# EAGLE board SE-Exp30 (EAGLE 9.6.2), part 1 of 2
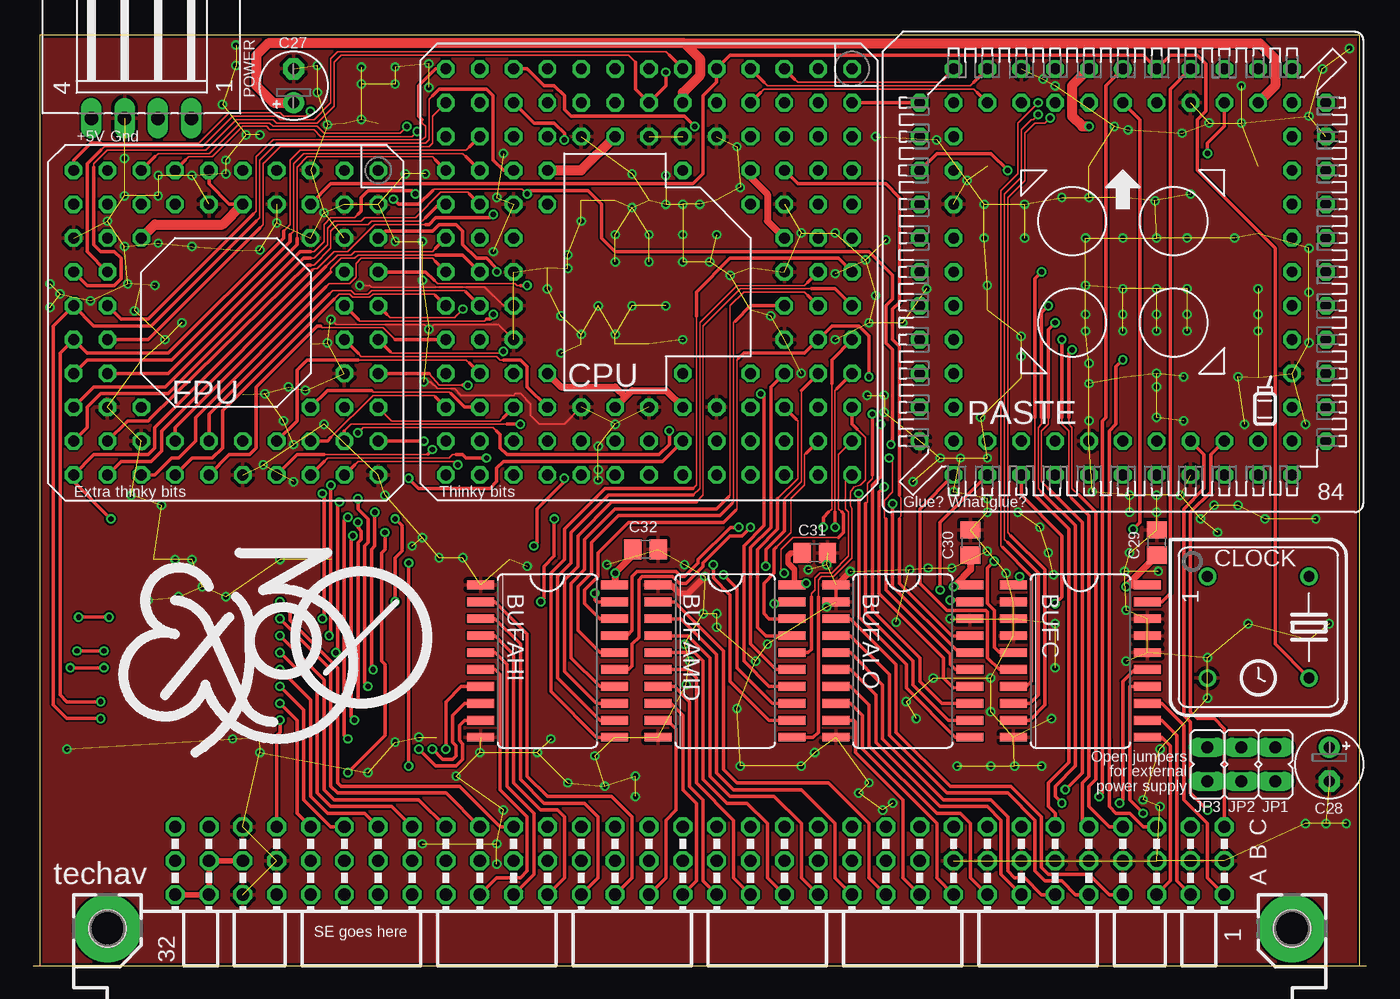
[diagram p1: board, top side]
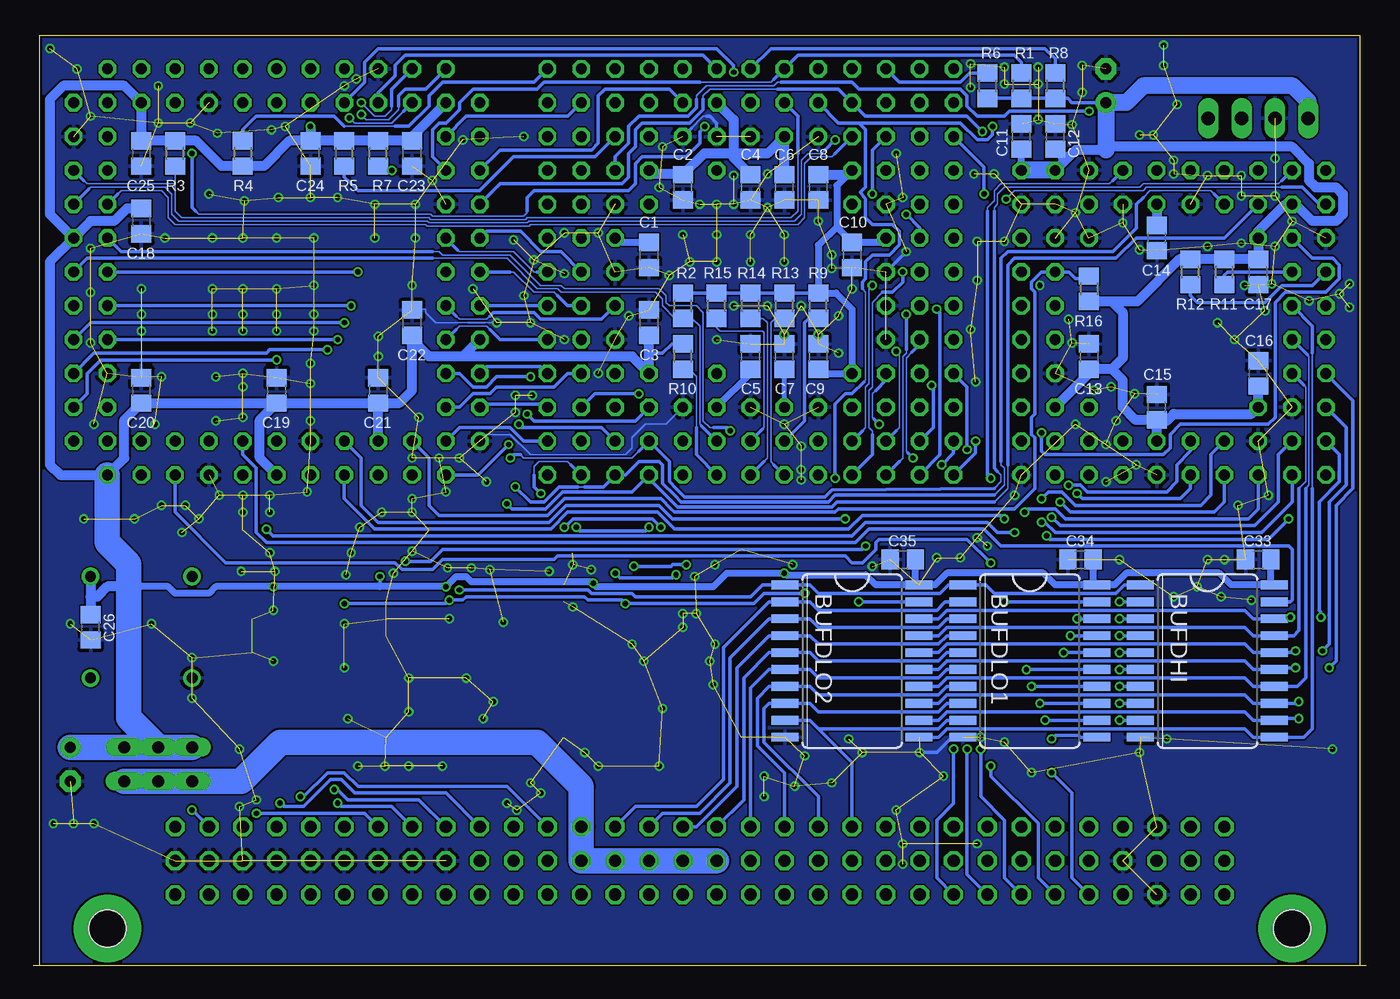
[diagram p2: board, bottom side, seen from below]

Size 99.06 x 69.85 mm. Coordinates in mm from the lower left corner, seen from the top.
Outline: 0,0 99.06,0 99.06,69.85 0,69.85 0,0
Copper layers (1*16): Top 0.035mm / dielectric 1.5mm / Bottom 0.035mm
Design rules "jlcpcb_v1 *": minimum track width 5mil, minimum drill 0.3mm, track to track 5mil, track to pad 5mil, pad to pad 5mil, via to via 5mil, smd to smd 0mil, copper to edge 0.2mm, drill to drill 10mil, minimum pad ring 10mil, minimum via ring 6mil, stop-mask expansion 2mil, vias tented up to drill 25mil, thermal gap 10mil

## Footprints (pad centres in the part's own frame; a part is rotated, then mirrored left to right if it is on the bottom)
74XX-US_SO20W = smd 0.66 x 2.032: 1 -5.715,-5.029; 2 -4.445,-5.029; 3 -3.175,-5.029; 4 -1.905,-5.029; 5 -0.635,-5.029; 6 0.635,-5.029; 7 1.905,-5.029; 8 3.175,-5.029; 9 4.445,-5.029; 10 5.715,-5.029; 11 5.715,5.029; 12 4.445,5.029; 13 3.175,5.029; 14 1.905,5.029; 15 0.635,5.029; 16 -0.635,5.029; 17 -1.905,5.029; 18 -3.175,5.029; 19 -4.445,5.029; 20 -5.715,5.029
RCL_C0805 = smd 1.3 x 1.5: 1 -0.95,0; 2 0.95,0
RCL_E2,5-5 = drill 0.813 pad 1.6: + -1.27,0 | drill 0.813 pad 1.6 octagon: - 1.27,0
CRYSTAL_DIL08S = drill 0.813: 1 -3.81,-3.81; 4 3.81,-3.81; 5 3.81,3.81; 8 -3.81,3.81
MICRO-MC68000_MPGA128 = drill 0.813 octagon: A01 -15.24,15.24; A02 -12.7,15.24; A03 -10.16,15.24; A04 -7.62,15.24; A05 -5.08,15.24; A06 -2.54,15.24; A07 0,15.24; A08 2.54,15.24; A09 5.08,15.24; A10 7.62,15.24; A11 10.16,15.24; A12 12.7,15.24; A13 15.24,15.24; B01 -15.24,12.7; B02 -12.7,12.7; B03 -10.16,12.7; B04 -7.62,12.7; B05 -5.08,12.7; B06 -2.54,12.7; B07 0,12.7; B08 2.54,12.7; B09 5.08,12.7; B10 7.62,12.7; B11 10.16,12.7; B12 12.7,12.7; B13 15.24,12.7; C01 -15.24,10.16; C02 -12.7,10.16; C03 -10.16,10.16; C04 -7.62,10.16; C05 -5.08,10.16; C06 -2.54,10.16; C07 0,10.16; C08 2.54,10.16; C09 5.08,10.16; C10 7.62,10.16; C11 10.16,10.16; C12 12.7,10.16; C13 15.24,10.16; D01 -15.24,7.62; D02 -12.7,7.62; D03 -10.16,7.62; D04 -7.62,7.62; D05 -5.08,7.62; D10 7.62,7.62; D11 10.16,7.62; D12 12.7,7.62; D13 15.24,7.62; E01 -15.24,5.08; E02 -12.7,5.08; E03 -10.16,5.08; E11 10.16,5.08; E12 12.7,5.08; E13 15.24,5.08; F01 -15.24,2.54; F02 -12.7,2.54; F03 -10.16,2.54; F04 -7.62,2.54; F10 7.62,2.54; F11 10.16,2.54; F12 12.7,2.54; F13 15.24,2.54; G01 -15.24,0; G02 -12.7,0; G03 -10.16,0; G11 10.16,0; G12 12.7,0; G13 15.24,0; H01 -15.24,-2.54; H02 -12.7,-2.54; H03 -10.16,-2.54; H11 10.16,-2.54; H12 12.7,-2.54; H13 15.24,-2.54; J01 -15.24,-5.08; J02 -12.7,-5.08; J03 -10.16,-5.08; J11 10.16,-5.08; J12 12.7,-5.08; J13 15.24,-5.08; K01 -15.24,-7.62; K02 -12.7,-7.62; K03 -10.16,-7.62; K04 -7.62,-7.62; K05 -5.08,-7.62; K10 7.62,-7.62; K11 10.16,-7.62; K12 12.7,-7.62; K13 15.24,-7.62; L01 -15.24,-10.16; L02 -12.7,-10.16; L03 -10.16,-10.16; L04 -7.62,-10.16; L05 -5.08,-10.16; L06 -2.54,-10.16; L07 0,-10.16; L08 2.54,-10.16; L09 5.08,-10.16; L10 7.62,-10.16; L11 10.16,-10.16; L12 12.7,-10.16; L13 15.24,-10.16; M01 -15.24,-12.7; M02 -12.7,-12.7; M03 -10.16,-12.7; M04 -7.62,-12.7; M05 -5.08,-12.7; M06 -2.54,-12.7; M07 0,-12.7; M08 2.54,-12.7; M09 5.08,-12.7; M10 7.62,-12.7; M11 10.16,-12.7; M12 12.7,-12.7; M13 15.24,-12.7; N01 -15.24,-15.24; N02 -12.7,-15.24; N03 -10.16,-15.24; N04 -7.62,-15.24; N05 -5.08,-15.24; N06 -2.54,-15.24; N07 0,-15.24; N08 2.54,-15.24; N09 5.08,-15.24; N10 7.62,-15.24; N11 10.16,-15.24; N12 12.7,-15.24; N13 15.24,-15.24
MICRO-MC68000_MPGA68 = drill 0.813 octagon: A01 -11.43,11.43; A02 -8.89,11.43; A03 -6.35,11.43; A04 -3.81,11.43; A05 -1.27,11.43; A06 1.27,11.43; A07 3.81,11.43; A08 6.35,11.43; A09 8.89,11.43; A10 11.43,11.43; B01 -11.43,8.89; B02 -8.89,8.89; B03 -6.35,8.89; B04 -3.81,8.89; B05 -1.27,8.89; B06 1.27,8.89; B07 3.81,8.89; B08 6.35,8.89; B09 8.89,8.89; B10 11.43,8.89; C01 -11.43,6.35; C02 -8.89,6.35; C03 -6.35,6.35; C08 6.35,6.35; C09 8.89,6.35; C10 11.43,6.35; D01 -11.43,3.81; D02 -8.89,3.81; D09 8.89,3.81; D10 11.43,3.81; E01 -11.43,1.27; E02 -8.89,1.27; E09 8.89,1.27; E10 11.43,1.27; F01 -11.43,-1.27; F02 -8.89,-1.27; F09 8.89,-1.27; F10 11.43,-1.27; G01 -11.43,-3.81; G02 -8.89,-3.81; G09 8.89,-3.81; G10 11.43,-3.81; H01 -11.43,-6.35; H02 -8.89,-6.35; H03 -6.35,-6.35; H08 6.35,-6.35; H09 8.89,-6.35; H10 11.43,-6.35; J01 -11.43,-8.89; J02 -8.89,-8.89; J03 -6.35,-8.89; J04 -3.81,-8.89; J05 -1.27,-8.89; J06 1.27,-8.89; J07 3.81,-8.89; J08 6.35,-8.89; J09 8.89,-8.89; J10 11.43,-8.89; K01 -11.43,-11.43; K02 -8.89,-11.43; K03 -6.35,-11.43; K04 -3.81,-11.43; K05 -1.27,-11.43; K06 1.27,-11.43; K07 3.81,-11.43; K08 6.35,-11.43; K09 8.89,-11.43; K10 11.43,-11.43
JUMPER_JP1 = drill 0.914 long: 1 0,-1.27; 2 0,1.27
SE-EXP30_S84 = drill 0.813: 1 0,15.24 | drill 0.813 octagon: 2 0,12.7; 3 -2.54,15.24; 4 -2.54,12.7; 5 -5.08,15.24; 6 -5.08,12.7; 7 -7.62,15.24; 8 -7.62,12.7; 9 -10.16,15.24; 10 -10.16,12.7; 11 -12.7,15.24; 12 -15.24,12.7; 13 -12.7,12.7; 14 -15.24,10.16; 15 -12.7,10.16; 16 -15.24,7.62; 17 -12.7,7.62; 18 -15.24,5.08; 19 -12.7,5.08; 20 -15.24,2.54; 21 -12.7,2.54; 22 -15.24,0; 23 -12.7,0; 24 -15.24,-2.54; 25 -12.7,-2.54; 26 -15.24,-5.08; 27 -12.7,-5.08; 28 -15.24,-7.62; 29 -12.7,-7.62; 30 -15.24,-10.16; 31 -12.7,-10.16; 32 -15.24,-12.7; 33 -12.7,-15.24; 34 -12.7,-12.7; 35 -10.16,-15.24; 36 -10.16,-12.7; 37 -7.62,-15.24; 38 -7.62,-12.7; 39 -5.08,-15.24; 40 -5.08,-12.7; 41 -2.54,-15.24; 42 -2.54,-12.7; 43 0,-15.24; 44 0,-12.7; 45 2.54,-15.24; 46 2.54,-12.7; 47 5.08,-15.24; 48 5.08,-12.7; 49 7.62,-15.24; 50 7.62,-12.7; 51 10.16,-15.24; 52 10.16,-12.7; 53 12.7,-15.24; 54 15.24,-12.7; 55 12.7,-12.7; 56 15.24,-10.16; 57 12.7,-10.16; 58 15.24,-7.62; 59 12.7,-7.62; 60 15.24,-5.08; 61 12.7,-5.08; 62 15.24,-2.54; 63 12.7,-2.54; 64 15.24,0; 65 12.7,0; 66 15.24,2.54; 67 12.7,2.54; 68 15.24,5.08; 69 12.7,5.08; 70 15.24,7.62; 71 12.7,7.62; 72 15.24,10.16; 73 12.7,10.16; 74 15.24,12.7; 75 12.7,15.24; 76 12.7,12.7; 77 10.16,15.24; 78 10.16,12.7; 79 7.62,15.24; 80 7.62,12.7; 81 5.08,15.24; 82 5.08,12.7; 83 2.54,15.24; 84 2.54,12.7
CON-AMP-MT_L04P = drill 1.016 long: 1 3.75,-6.25; 2 1.25,-6.25; 3 -1.25,-6.25; 4 -3.75,-6.25
RCL_R0805 = smd 1.3 x 1.5: 1 -0.95,0; 2 0.95,0
CON-VG_MABC96LP = drill 0.914 octagon: A1 -2.54,39.37; A2 -2.54,36.83; A3 -2.54,34.29; A4 -2.54,31.75; A5 -2.54,29.21; A6 -2.54,26.67; A7 -2.54,24.13; A8 -2.54,21.59; A9 -2.54,19.05; A10 -2.54,16.51; A11 -2.54,13.97; A12 -2.54,11.43; A13 -2.54,8.89; A14 -2.54,6.35; A15 -2.54,3.81; A16 -2.54,1.27; A17 -2.54,-1.27; A18 -2.54,-3.81; A19 -2.54,-6.35; A20 -2.54,-8.89; A21 -2.54,-11.43; A22 -2.54,-13.97; A23 -2.54,-16.51; A24 -2.54,-19.05; A25 -2.54,-21.59; A26 -2.54,-24.13; A27 -2.54,-26.67; A28 -2.54,-29.21; A29 -2.54,-31.75; A30 -2.54,-34.29; A31 -2.54,-36.83; A32 -2.54,-39.37; B1 -5.08,39.37; B2 -5.08,36.83; B3 -5.08,34.29; B4 -5.08,31.75; B5 -5.08,29.21; B6 -5.08,26.67; B7 -5.08,24.13; B8 -5.08,21.59; B9 -5.08,19.05; B10 -5.08,16.51; B11 -5.08,13.97; B12 -5.08,11.43; B13 -5.08,8.89; B14 -5.08,6.35; B15 -5.08,3.81; B16 -5.08,1.27; B17 -5.08,-1.27; B18 -5.08,-3.81; B19 -5.08,-6.35; B20 -5.08,-8.89; B21 -5.08,-11.43; B22 -5.08,-13.97; B23 -5.08,-16.51; B24 -5.08,-19.05; B25 -5.08,-21.59; B26 -5.08,-24.13; B27 -5.08,-26.67; B28 -5.08,-29.21; B29 -5.08,-31.75; B30 -5.08,-34.29; B31 -5.08,-36.83; B32 -5.08,-39.37; C1 -7.62,39.37; C2 -7.62,36.83; C3 -7.62,34.29; C4 -7.62,31.75; C5 -7.62,29.21; C6 -7.62,26.67; C7 -7.62,24.13; C8 -7.62,21.59; C9 -7.62,19.05; C10 -7.62,16.51; C11 -7.62,13.97; C12 -7.62,11.43; C13 -7.62,8.89; C14 -7.62,6.35; C15 -7.62,3.81; C16 -7.62,1.27; C17 -7.62,-1.27; C18 -7.62,-3.81; C19 -7.62,-6.35; C20 -7.62,-8.89; C21 -7.62,-11.43; C22 -7.62,-13.97; C23 -7.62,-16.51; C24 -7.62,-19.05; C25 -7.62,-21.59; C26 -7.62,-24.13; C27 -7.62,-26.67; C28 -7.62,-29.21; C29 -7.62,-31.75; C30 -7.62,-34.29; C31 -7.62,-36.83; C32 -7.62,-39.37 | drill 2.794 pad 5.08: X1 0,44.45; X2 0,-44.45 | hole 2.794: 0,44.45; 0,-44.45

## Placement (x,y rotation side)
BUFAHI  74VHCT245  [74XX-US_SO20W]  38.1,22.86 270 top
BUFALO  74VHCT245  [74XX-US_SO20W]  64.77,22.86 270 top
BUFAMID  74VHCT245  [74XX-US_SO20W]  51.44,22.86 270 top
BUFC  74VHCT245  [74XX-US_SO20W]  78.11,22.86 270 top
BUFDHI  74VHCT245  [74XX-US_SO20W]  11.43,22.86 270 bottom
BUFDLO1  74VHCT245  [74XX-US_SO20W]  24.77,22.86 270 bottom
BUFDLO2  74VHCT245  [74XX-US_SO20W]  38.1,22.86 270 bottom
C1  1uF  [RCL_C0805]  53.34,53.34 270 bottom
C2  1uF  [RCL_C0805]  50.8,58.42 270 bottom
C3  1uF  [RCL_C0805]  53.34,48.26 90 bottom
C4  1uF  [RCL_C0805]  45.72,58.42 270 bottom
C5  1uF  [RCL_C0805]  45.72,45.72 90 bottom
C6  1uF  [RCL_C0805]  43.18,58.42 270 bottom
C7  1uF  [RCL_C0805]  43.18,45.72 90 bottom
C8  1uF  [RCL_C0805]  40.64,58.42 270 bottom
C9  1uF  [RCL_C0805]  40.64,45.72 90 bottom
C10  1uF  [RCL_C0805]  38.1,53.34 270 bottom
C11  1uF  [RCL_C0805]  25.4,62.23 90 bottom
C12  1uF  [RCL_C0805]  22.86,62.23 90 bottom
C13  1uF  [RCL_C0805]  20.32,45.72 90 bottom
C14  1uF  [RCL_C0805]  15.24,54.61 270 bottom
C15  1uF  [RCL_C0805]  15.24,41.91 90 bottom
C16  1uF  [RCL_C0805]  7.62,44.45 90 bottom
C17  1uF  [RCL_C0805]  7.62,52.07 270 bottom
C18  1uF  [RCL_C0805]  91.44,55.88 270 bottom
C19  1uF  [RCL_C0805]  81.28,43.18 90 bottom
C20  1uF  [RCL_C0805]  91.44,43.18 90 bottom
C21  1uF  [RCL_C0805]  73.66,43.18 90 bottom
C22  1uF  [RCL_C0805]  71.12,48.26 90 bottom
C23  1uF  [RCL_C0805]  71.12,60.96 270 bottom
C24  1uF  [RCL_C0805]  78.74,60.96 270 bottom
C25  1uF  [RCL_C0805]  91.44,60.96 270 bottom
C26  1uF  [RCL_C0805]  95.25,25.4 270 bottom
C27  10uF  [RCL_E2,5-5]  19.05,66.04 90 top
C28  10uF  [RCL_E2,5-5]  96.77,15.11 270 top
C29  1uF  [RCL_C0805]  83.82,31.75 90 top
C30  1uF  [RCL_C0805]  69.85,31.75 90 top
C31  1uF  [RCL_C0805]  58.17,30.99 0 top
C32  1uF  [RCL_C0805]  45.47,31.24 0 top
C33  1uF  [RCL_C0805]  7.62,30.48 180 bottom
C34  1uF  [RCL_C0805]  20.95,30.48 180 bottom
C35  1uF  [RCL_C0805]  34.29,30.48 180 bottom
CLOCK  [CRYSTAL_DIL08S]  91.44,25.4 270 top
CPU  68030  [MICRO-MC68000_MPGA128]  45.72,52.07 270 top
FPU  68882  [MICRO-MC68000_MPGA68]  13.97,48.26 270 top
JP1  [JUMPER_JP1]  92.71,15.11 0 top
JP2  [JUMPER_JP1]  90.17,15.11 0 top
JP3  [JUMPER_JP1]  87.63,15.11 0 top
PASTE  ATF1504AS  [SE-EXP30_S84]  81.28,52.07 0 top
POWER  [CON-AMP-MT_L04P]  7.62,69.85 0 top
R1  4k7  [RCL_R0805]  25.4,66.04 270 bottom
R2  4k7  [RCL_R0805]  50.8,49.53 90 bottom
R3  4k7  [RCL_R0805]  88.9,60.96 90 bottom
R4  4k7  [RCL_R0805]  83.82,60.96 270 bottom
R5  4k7  [RCL_R0805]  76.2,60.96 90 bottom
R6  4k7  [RCL_R0805]  27.94,66.04 270 bottom
R7  4k7  [RCL_R0805]  73.66,60.96 90 bottom
R8  4k7  [RCL_R0805]  22.86,66.04 270 bottom
R9  4k7  [RCL_R0805]  40.64,49.53 90 bottom
R10  4k7  [RCL_R0805]  50.8,45.72 90 bottom
R11  4k7  [RCL_R0805]  10.16,52.07 90 bottom
R12  4k7  [RCL_R0805]  12.7,52.07 90 bottom
R13  4k7  [RCL_R0805]  43.18,49.53 90 bottom
R14  4k7  [RCL_R0805]  45.72,49.53 90 bottom
R15  4k7  [RCL_R0805]  48.26,49.53 90 bottom
R16  4k7  [RCL_R0805]  20.32,50.8 270 bottom
U$1  [BUFFALO]  61.98,16.76 0 top
X1  CON-VG_MABC96LP  [CON-VG_MABC96LP]  49.53,2.79 270 top